# EAGLE design sqrwear-mini (EAGLE 6.5.0)
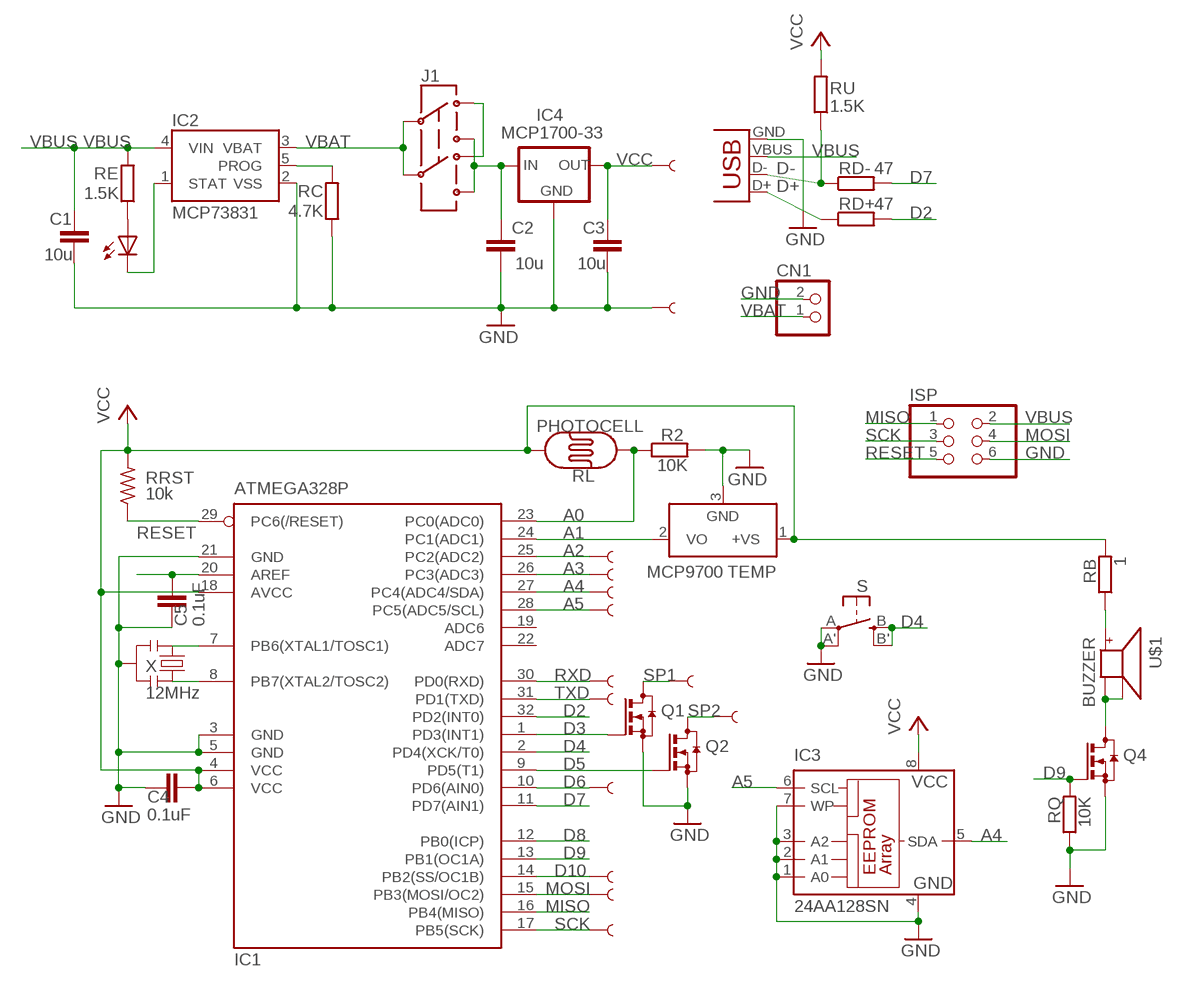
[diagram p0: schematic, sheet 1]

## Parts
C1  10u  C-EUC0805K  [C0805K]
C2  10u  C-EUC0805K  [C0805K]
C3  10u  C-EUC0805K  [C0805K]
C4  0.1uF  C-EUC0805K  [C0805K]
C5  0.1uF  C-EUC0805K  [C0805K]
CHG  0805  LEDCHIPLED_0805  [CHIPLED_0805]
CN1  JST_2PIN-SMT-RA  [JST-PH-2-SMT-RA]
IC1  ATMEGA328P  MEGA8-AI  [TQFP32-08]
IC2  MCP73831  [SOT23-5]
IC3  24AA128SN  [SO-08]
IC4  MCP1700-33  MCP1700SOT233  [SOT23]
ISP  PINHD-2X3  [2X03]
J1  AYZ0202  [AYZ0202]
PAD_3  SEWTAP6  SEWTAP611  [PETAL-SMALL-2SIDE11]
PAD_5  SEWTAP6  SEWTAP61  [PETAL-SMALL-2SIDE1]
PAD_6  SEWTAP6  SEWTAP61  [PETAL-SMALL-2SIDE1]
PAD_10  SEWTAP6  SEWTAP611  [PETAL-SMALL-2SIDE11]
PAD_11  SEWTAP6  SEWTAP61  [PETAL-SMALL-2SIDE1]
PAD_13  SEWTAP6  SEWTAP61  [PETAL-SMALL-2SIDE1]
PAD_A2  SEWTAP6  SEWTAP61  [PETAL-SMALL-2SIDE1]
PAD_A3  SEWTAP6  SEWTAP61  [PETAL-SMALL-2SIDE1]
PAD_A4  SEWTAP6  SEWTAP611  [PETAL-SMALL-2SIDE11]
PAD_A5  SEWTAP6  SEWTAP611  [PETAL-SMALL-2SIDE11]
PAD_GND  SEWTAP6  SEWTAP611  [PETAL-SMALL-2SIDE11]
PAD_RXD  SEWTAP61  [PETAL-SMALL-2SIDE1]
PAD_TXD  SEWTAP6  SEWTAP61  [PETAL-SMALL-2SIDE1]
PAD_VCC  SEWTAP6  SEWTAP611  [PETAL-SMALL-2SIDE11]
Q1  BSS123  [SOT23]
Q2  BSS123  [SOT23]
Q4  BSS123  [SOT23]
R2  10K  R-EU_R0805  [R0805]
RB  1  R-EU_R0805  [R0805]
RC  4.7K  R-EU_R0805  [R0805]
RD+  47  R-EU_R0805  [R0805]
RD-  47  R-EU_R0805  [R0805]
RE  1.5K  R-EU_R0805  [R0805]
RL  PHOTOCELL  PHOTOCELLPTH  [PHOTOCELL]
RQ  10K  R-EU_R0805  [R0805]
RRST  10k  R-US_R0805  [R0805]
RU  1.5K  R-EU_R0805  [R0805]
S  EVQQ2  [EVQ-Q2]
TEMP  MCP9700  LM50  [SOT23]
U$1  BUZZER  [SMT-8585-BUZZER]
X  12MHz  RESONATORSMD  [RESONATOR-SMD]
X1  USBSMD  [USB-MINIB]

## Nets
A0: IC1.23(PC0(ADC0)) R2.1 RL.1
A1: IC1.24(PC1(ADC1)) TEMP.2(VO)
A2: IC1.25(PC2(ADC2)) PAD_A2.1
A3: IC1.26(PC3(ADC3)) PAD_A3.1
A4: IC1.27(PC4(ADC4/SDA)) IC3.5(SDA) PAD_A4.1
A5: IC1.28(PC5(ADC5/SCL)) IC3.6(SCL) PAD_A5.1
AREF: C5.2 IC1.20(AREF)
D2: IC1.32(PD2(INT0)) RD+.2
D3: IC1.1(PD3(INT1)) Q1.1(G)
D4: IC1.2(PD4(XCK/T0)) S.B'(S1) S.B(S)
D5: IC1.9(PD5(T1)) Q2.1(G)
D6: IC1.10(PD6(AIN0)) PAD_6.1
D7: IC1.11(PD7(AIN1)) RD-.2
D8: IC1.12(PB0(ICP))
D9: IC1.13(PB1(OC1A)) Q4.1(G) RQ.2
D10: IC1.14(PB2(SS/OC1B)) PAD_10.1
D+: RD+.1 X1.D+
D-: RD-.1 RU.1 X1.D-
GND: C1.2 C2.2 C3.2 C4.1 C5.1 CN1.2 IC1.3(GND) IC1.5(GND) IC1.21(GND) IC2.2(VSS) IC3.1(A0) IC3.2(A1) IC3.3(A2) IC3.4(GND) IC3.7(WP) IC4.1(GND) ISP.6 PAD_GND.1 Q1.2(S) Q2.2(S) Q4.2(S) R2.2 RC.1 RQ.1 S.A'(P1) S.A(P) TEMP.3(GND) X1.GND X.2
MISO: IC1.16(PB4(MISO)) ISP.1
MOSI: IC1.15(PB3(MOSI/OC2)) ISP.4 PAD_11.1
N$1: J1.3 J1.6
N$2: IC1.7(PB6(XTAL1/TOSC1)) X.1
N$3: IC1.8(PB7(XTAL2/TOSC2)) X.3
N$4: CHG.A RE.1
N$5: CHG.C IC2.1(STAT)
N$6: IC2.5(PROG) RC.2
N$7: Q4.3(D) U$1.- U$1.A-
N$12: RB.1 U$1.+
RESET: IC1.29(PC6(/RESET)) ISP.5 RRST.1
RXD: IC1.30(PD0(RXD)) PAD_RXD.1
SCK: IC1.17(PB5(SCK)) ISP.3 PAD_13.1
SP1: PAD_3.1 Q1.3(D)
SP2: PAD_5.1 Q2.3(D)
TXD: IC1.31(PD1(TXD)) PAD_TXD.1
VBAT: CN1.1 IC2.3(VBAT) J1.2 J1.5
VBUS: C1.1 IC2.4(VIN) ISP.2 RE.2 X1.VBUS
VCC: C3.1 C4.2 IC1.4(VCC) IC1.6(VCC) IC1.18(AVCC) IC3.8(VCC) IC4.2(OUT) PAD_VCC.1 RB.2 RL.2 RRST.2 RU.2 TEMP.1(+VS)
VDD: C2.1 IC4.3(IN) J1.1 J1.4
Unconnected: IC1.19(ADC6) IC1.22(ADC7)

## Library data of the parts
C1-C3 = resistor:C-EU: CAPACITOR, European symbol
C4 C5 = rcl:C-EU: CAPACITOR, European symbol
CHG = led:LED: LED OSRAM: - CHIPLED LG R971, LG N971, LY N971, LG Q971, LY Q971, LO R971, LY R971 LH N974, LH R974 LS Q976, LO Q976, LY Q976 LO Q996 - Hyper CHIPLED LW Q18S LB Q993, LB Q99A, LB R99A - SideLED LS A670, LO A670, LY A670, LG A670, LP A670 LB A673, LV A673, LT A673, LW A673 LH A674 LY A675 LS A676, LA A676, LO A676, LY A676, LW A676 LS A679, LY A679, LG A679 - Hyper Micro SIDELED® LS Y876, LA Y876, LO Y876, LY Y876 LT Y87S - SmartLED LW L88C, LW L88S LB L89C, LB L89S, LG L890 LS L89K, LO L89K, LY L89K LS L896, LA L896, LO L896, LY L896 - TOPLED LS T670, LO T670, LY T670, LG T670, LP T670 LSG T670, LSP T670, LSY T670, LOP T670, LYG T670 LG T671, LOG T671, LSG T671 LB T673, LV T673, LT T673, LW T673 LH T674 LS T676, LA T676, LO T676, LY T676, LB T676, LH T676, LSB T676, LW T676 LB T67C, LV T67C, LT T67C, LS T67K, LO T67K, LY T67K, LW E67C LS E67B, LA E67B, LO E67B, LY E67B, LB E67C, LV E67C, LT E67C LW T67C LS T679, LY T679, LG T679 LS T770, LO T770, LY T770, LG T770, LP T770 LB T773, LV T773, LT T773, LW T773 LH T774 LS E675, LA E675, LY E675, LS T675 LS T776, LA T776, LO T776, LY T776, LB T776 LHGB T686 LT T68C, LB T68C - Hyper Mini TOPLED® LB M676 - Mini TOPLED Santana® LG M470 LS M47K, LO M47K, LY M47K Source: http://www.osram.convergy.de LUXEON: - LUMILED® LXK2-PW12-R00, LXK2-PW12-S00, LXK2-PW14-U00, LXK2-PW14-V00 LXK2-PM12-R00, LXK2-PM12-S00, LXK2-PM14-U00 LXK2-PE12-Q00, LXK2-PE12-R00, LXK2-PE12-S00, LXK2-PE14-T00, LXK2-PE14-U00 LXK2-PB12-K00, LXK2-PB12-L00, LXK2-PB12-M00, LXK2-PB14-N00, LXK2-PB14-P00, LXK2-PB14-Q00 LXK2-PR12-L00, LXK2-PR12-M00, LXK2-PR14-Q00, LXK2-PR14-R00 LXK2-PD12-Q00, LXK2-PD12-R00, LXK2-PD12-S00 LXK2-PH12-R00, LXK2-PH12-S00 LXK2-PL12-P00, LXK2-PL12-Q00, LXK2-PL12-R00 Source: www.luxeon.com KINGBRIGHT: KA-3528ASYC Source: www.kingbright.com
CN1 = adafruit:JST_2PIN: JST 2-Pin Connectors of various flavors SMT-RA (S2B-PH-SM4) 4UConnector #17311 SMT (B2B-PH-SM4) THM-RA (S2B-PH) THM (B2B-PH)
IC1 = atmel:MEGA8: MICROCONTROLLER 8 Kbytes FLASH, 1 kbytes SRAM, 512 bytes EEPROM, USART, 6-channel 10 bit ADC, 2-channel 8 bit ADC Pin compatible with Atmega48, ATMega88, ATMega168 Source: avr.lbr; MPN: ATMEGA8-16AU; OC_FARNELL: 9171371; OC_NEWARK: 73M8863
IC2 = SparkFunNew:MCP73831: Microchip's MCP73831 Miniature single cell, fully integrated Li-Ion, Li-polymer charge management controller http://ww1.microchip.com/downloads/en/DeviceDoc/21984a.pdf
IC3 = microchip:24*: Serial EEPROM I2C; MF: MICROCHIP; MPN: 24AA128-I/SN; OC_FARNELL: unknown; OC_NEWARK: 92C6842
IC4 = adafruit:MCP1700: VOLTAGE REGULATOR
ISP = pinhead:PINHD-2X3: PIN HEADER
J1 = SparkFunNew:AYZ0202: SPDT Slide Switch Simple SMD single-pull double-throw slide switch. Good for less than 350mA power switch, switching UARTs between devices, etc. Spark Fun Electronics SKU : COM-00597
PAD_3 PAD_5 PAD_6 PAD_10 PAD_11 PAD_13 PAD_A2-PAD_A5 PAD_GND PAD_RXD PAD_TXD PAD_VCC = LilyPad-Wearables:SEWTAP
Q1 Q2 Q4 = transistor-small-signal:BSS123: N-CHANNEL MOS FET
R2 RB RC RD+ RD- RE RQ RU = rcl:R-EU_: RESISTOR, European symbol
RL = SparkFunNew:PHOTOCELL: Photocell Also known as a CdS photoresistor. This is a low cost way to detect light levels. Resistance decreases with more incoming light. SparkFun SKU: SEN-09088
RRST = rcl:R-US_: RESISTOR, American symbol
S = adafruit:EVQQ2: SMT 6mm switch, EVQQ2 series http://www.ladyada.net/library/eagle
TEMP = linear:LM50: SOT-23 Single-Supply Centigrade Temperature Sensor Vout = (10mV/°C x Temp °C) +5mmmV Source: http://cache.national.com/ds/LM/LM50.pdf
U$1 = adafruit:BUZZER
X = SparkFunNew:RESONATOR: Resonator Small SMD resonator. This is the itty bitty 10/20MHz resonators with built in caps. CSTCE10M0G55 and CSTCE20M0V53. Footprint has been reviewed closely but hasn't been tested yet.
X1 = SparkFun:USB: USB Connectors USB-B-PTH is fully proven SKU : PRT-00139 USB-miniB is fully proven SKU : PRT-00587 USB-A-PCB is untested. USB-A-H is throughly reviewed, but untested. Spark Fun Electronics SKU : PRT-00437 USB-B-SMT is throughly reviewed, but untested. Needs silkscreen touching up. USB-A-S has not been used/tested USB-MB-H has not been used/tested

## Net classes
0 default: width 0.203 mm, clearance 0.203 mm
1 power: width 0.203 mm, clearance 0.203 mm

## Board
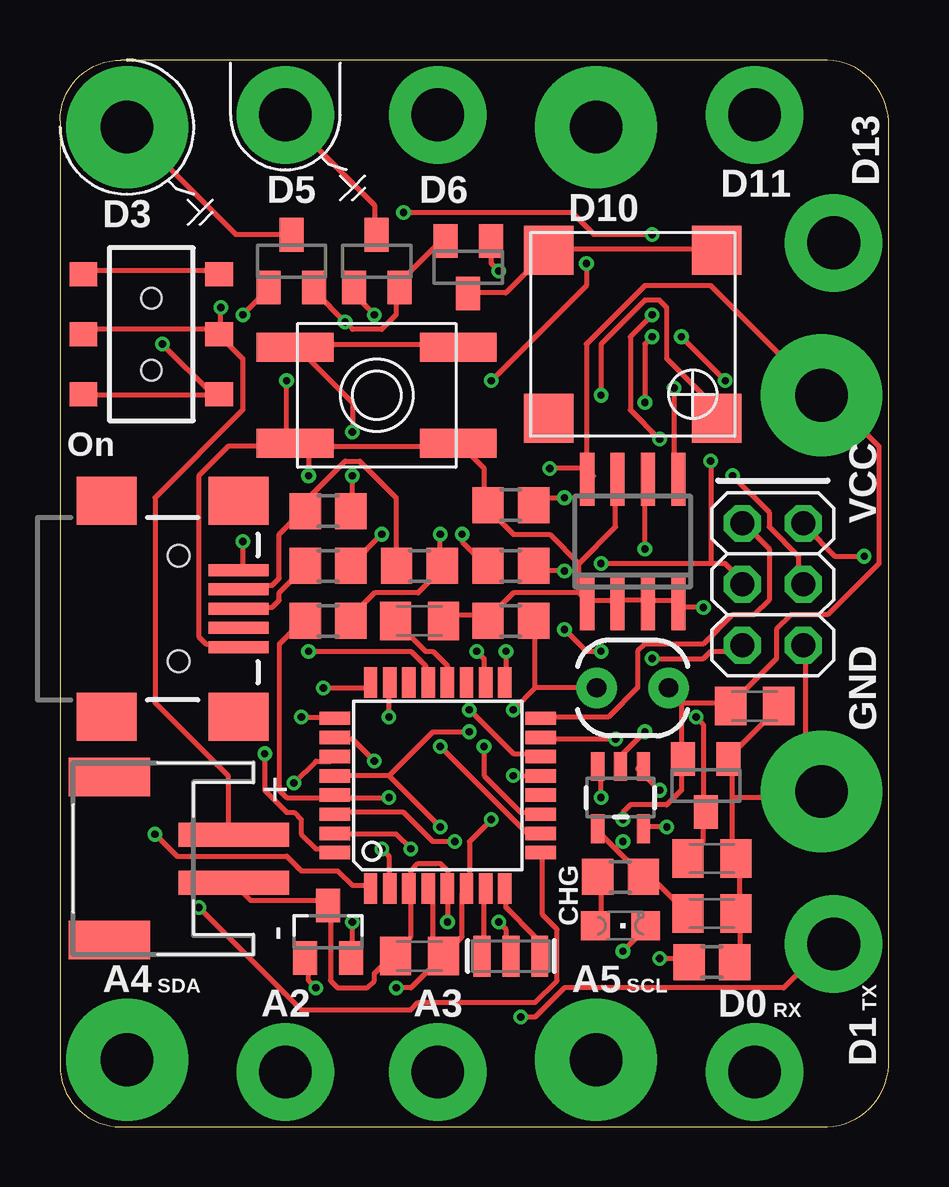
[diagram p1: board, top side]
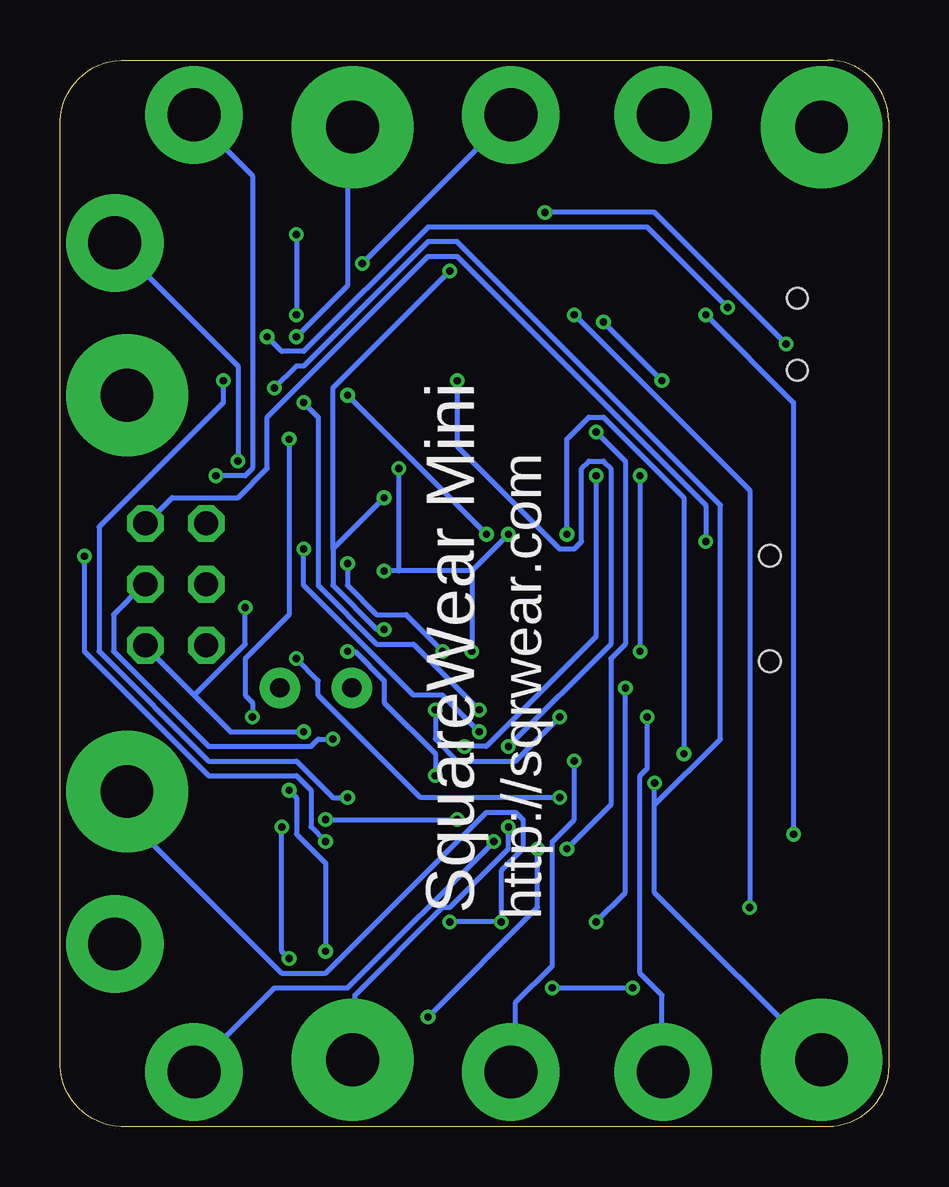
[diagram p2: board, bottom side, seen from below]

Size 34.54 x 44.45 mm. Coordinates in mm from the lower left corner, seen from the top.
Outline: 2.54,0 31.75,0 arc90 34.54,2.54 34.54,41.91 arc90 31.75,44.45 2.54,44.45 arc90 0,41.91 0,2.54 arc90 2.54,0
Copper layers (1*16): Top 0.035mm / dielectric 1.5mm / Bottom 0.035mm
Design rules "Fusion_eagle_rule_v1.1 *": minimum track width 6mil, minimum drill 12mil, track to track 6mil, track to pad 6mil, pad to pad 6mil, via to via 6mil, smd to smd 0mil, copper to edge 10mil, drill to drill 10mil, minimum pad ring 10mil, minimum via ring 6mil, stop-mask expansion 2mil, vias tented up to drill 100mil, thermal gap 25mil
vRestrict: area 20.8,8.4 to 21.6,10.4; area 21.1,37.6 to 23.9,38.9; area 8.4,4.6 to 10.4,5.6

### Footprints (pad centres in the part's own frame; a part is rotated, then mirrored left to right if it is on the bottom)
C0805K = smd 1.3 x 1.6: 1 -1,0; 2 1,0
CHIPLED_0805 = smd 1.2 x 1.2: A 0,-1.05; C 0,1.05
JST-PH-2-SMT-RA = smd 1 x 4.6: 1 1,-3.7; 2 -1,-3.7 | smd 1.6 x 3.4: NC1 -3.4,1.5; NC2 3.4,1.5
TQFP32-08 = smd 1.27 x 0.559: 1 -4.293,2.8; 2 -4.293,2; 3 -4.293,1.2; 4 -4.293,0.4; 5 -4.293,-0.4; 6 -4.293,-1.2; 7 -4.293,-2; 8 -4.293,-2.8; 17 4.293,-2.8; 18 4.293,-2; 19 4.293,-1.2; 20 4.293,-0.4; 21 4.293,0.4; 22 4.293,1.2; 23 4.293,2; 24 4.293,2.8 | smd 0.559 x 1.27: 9 -2.8,-4.293; 10 -2,-4.293; 11 -1.2,-4.293; 12 -0.4,-4.293; 13 0.4,-4.293; 14 1.2,-4.293; 15 2,-4.293; 16 2.8,-4.293; 25 2.8,4.293; 26 2,4.293; 27 1.2,4.293; 28 0.4,4.293; 29 -0.4,4.293; 30 -1.2,4.293; 31 -2,4.293; 32 -2.8,4.293
SOT23-5 = smd 0.55 x 1.2: 1 -0.95,-1.3; 2 0,-1.3; 3 0.95,-1.3; 4 0.95,1.3; 5 -0.95,1.3
SO-08 = smd 0.6 x 2.2: 1 -1.905,-2.6; 2 -0.635,-2.6; 3 0.635,-2.6; 4 1.905,-2.6; 5 1.905,2.6; 6 0.635,2.6; 7 -0.635,2.6; 8 -1.905,2.6
SOT23 = smd 1 x 1.4: 1 -0.95,-1.1; 2 0.95,-1.1; 3 0,1.1
2X03 = drill 1.016 octagon: 1 -2.54,-1.27; 2 -2.54,1.27; 3 0,-1.27; 4 0,1.27; 5 2.54,-1.27; 6 2.54,1.27
AYZ0202 = smd 1 x 1.15: 1 -2.5,2.825; 2 0,2.825; 3 2.5,2.825; 4 -2.5,-2.825; 5 0,-2.825; 6 2.5,-2.825 | hole 0.85: 1.5,0; -1.5,0
PETAL-SMALL-2SIDE11 = drill 2.2 pad 5.08: 1 0,0
PETAL-SMALL-2SIDE1 = drill 2.2 pad 4.064: 1 0,0
R0805 = smd 1.3 x 1.5: 1 -0.95,0; 2 0.95,0
PHOTOCELL = drill 0.8 pad 1.676: 1 -1.5,0; 2 1.5,0
EVQ-Q2 = smd 3.2 x 1.2: A -3.4,-2; A' 3.4,-2; B -3.4,2; B' 3.4,2
SMT-8585-BUZZER = smd 2.05 x 2.05: + -3.5,-3.5; - 3.5,-3.5; A- 3.5,3.5; NC1 -3.5,3.5
RESONATOR-SMD = smd 0.7 x 1.7: 1 -1.2,0; 2 0,0; 3 1.2,0
USB-MINIB = smd 2.5 x 0.5: D+ 2.5,0; D- 2.5,0.8; GND 2.5,-1.6; ID 2.5,-0.8; VBUS 2.5,1.6 | smd 2.5 x 2: GND@1 -3,-4.5; GND@2 -3,4.5; GND@3 2.5,4.5; GND@4 2.5,-4.5 | hole 0.9: 0,2.2; 0,-2.2

### Placement (x,y rotation side)
C1  27.18,8.89 0 top
C2  27.18,11.18 0 top
C3  28.96,17.53 0 top
C4  14.99,7.11 0 top
C5  14.99,21.08 180 top
CHG  23.37,8.38 270 top
CN1  3.56,11.18 90 top
IC1  15.75,14.22 90 top
IC2  23.37,13.72 180 top
IC3  23.88,24.38 0 top
IC4  26.92,14.22 180 top
ISP  29.72,22.61 270 top
J1  3.81,33.02 90 top
PAD_3  2.79,41.66 180 top
PAD_5  9.4,42.16 180 top
PAD_6  15.75,42.16 0 top
PAD_10  22.35,41.66 180 top
PAD_11  28.96,42.16 180 top
PAD_13  32.26,36.83 180 top
PAD_A2  9.4,2.29 0 top
PAD_A3  15.75,2.29 0 top
PAD_A4  2.79,2.79 90 top
PAD_A5  22.35,2.79 0 top
PAD_GND  31.75,13.97 270 top
PAD_RXD  28.96,2.29 180 top
PAD_TXD  32.26,7.62 0 top
PAD_VCC  31.75,30.48 180 top
Q1  9.65,36.07 0 top
Q2  13.21,36.07 0 top
Q4  17.02,35.81 180 top
R2  18.8,21.08 180 top
RB  18.8,23.37 0 top
RC  27.18,6.86 180 top
RD+  11.18,23.37 0 top
RD-  11.18,25.65 0 top
RE  23.37,10.41 0 top
RL  23.88,18.29 0 top
RQ  18.8,25.91 0 top
RRST  11.18,21.08 0 top
RU  14.99,23.37 0 top
S  13.21,30.48 0 top
TEMP  11.18,8.13 0 top
U$1  23.88,33.02 90 top
X  18.8,7.11 0 top
X1  4.95,21.59 0 top

### Tracks (layer width: path | path; a pad name or v marks a point on that pad's centre or on a via)
A0  (via drill 0.3)
  Top 0.203: v13.72,17.07 13.72,18.29 IC1.23 | 19.81,18.29 v18.9,17.37 | RL.1 19.81,18.29 | 19.81,18.29 19.81,21.03 R2.1
  Bottom 0.203: v13.72,17.07 15.54,15.24 17.98,15.24 18.9,16.15 v18.9,17.37
A1  (via drill 0.3)
  Top 0.203: v10.97,18.29 12.8,18.29 IC1.24 | v12.19,8.53 12.19,7.32 TEMP.2
  Bottom 0.203: v10.97,18.29 10.97,9.75 v12.19,8.53
A2  (via drill 0.3)
  Top 0.203: v10.06,17.07 11.28,17.07 IC1.25
  Bottom 0.203: v10.06,17.07 10.06,14.94 10.36,14.63 10.36,6.4 9.45,5.49 9.45,2.44 PAD_A2.1
A3  (via drill 0.3)
  Top 0.203: v13.11,15.24 12.19,16.15 11.58,16.15 IC1.26
  Bottom 0.203: v13.11,15.24 13.11,12.8 14.02,11.89 14.02,6.71 15.54,5.18 15.54,2.44 PAD_A3.1
A4  (via drill 0.3)
  Top 0.203: v9.75,14.33 10.67,15.24 11.28,15.24 IC1.27 | v25.6,30.79 25.6,27.13 IC3.5
  Bottom 0.203: 9.75,13.41 9.75,9.75 PAD_A4.1 | 9.75,13.41 v9.75,14.33 | v25.6,30.79 24.69,31.7 24.38,31.7 19.2,36.88 17.98,36.88 7.01,25.91 7.01,16.15 9.75,13.41
A5  (via drill 0.3)
  Top 0.203: 13.72,14.63 11.58,14.63 IC1.28 | v15.85,12.5 13.72,14.63 | v24.38,24.08 24.38,26.82 IC3.6 | v17.07,16.46 15.54,16.46 13.72,14.63
  Bottom 0.203: v15.85,12.5 15.85,11.58 18.29,9.14 18.59,9.14 22.25,5.49 22.25,3.05 PAD_A5.1 | v24.38,24.08 24.38,22.56 19.81,17.98 18.59,17.98 v17.07,16.46
AREF
  Top 0.203: IC1.20 16.15,18.59 16.15,19.2 15.54,19.81 15.24,19.81 14.02,21.03 C5.2
D2  (via drill 0.3)
  Top 0.203: v8.53,15.55 8.53,14.02 9.45,13.11 9.75,13.11 10.06,12.8 10.06,12.19 10.67,11.58 11.28,11.58 IC1.32 | v13.41,24.69 12.19,23.47 RD+.2
  Bottom 0.203: v8.53,15.55 8.53,26.21 11.89,29.57 12.5,29.57 13.41,28.65 v13.41,24.69
D3  (via drill 0.3)
  Top 0.203: v3.96,12.19 4.88,11.28 9.45,11.28 10.06,10.67 11.58,10.67 12.19,10.06 12.8,10.06 IC1.1 | v7.62,33.83 8.53,34.75 Q1.1
  Bottom 0.203: v3.96,12.19 3.96,30.18 v7.62,33.83
D4  (via drill 0.3)
  Top 0.203: v13.41,11.58 13.72,11.28 13.72,10.06 IC1.2 | v12.19,28.96 12.19,30.18 10.06,32.31 S.B 10.06,32.61 16.46,32.61 S.B'
  Bottom 0.203: v13.41,11.58 11.58,13.41 11.58,19.51 10.97,20.12 10.97,27.74 v12.19,28.96
D5  (via drill 0.3)
  Top 0.203: v5.79,9.14 10.06,4.88 14.63,4.88 14.94,5.18 19.81,5.18 20.73,6.1 20.73,8.23 20.12,8.84 20.12,11.28 IC1.9 | v13.11,33.83 12.19,34.75 Q2.1
  Bottom 0.203: v5.79,9.14 5.79,26.52 v13.11,33.83
D6  (via drill 0.3)
  Top 0.203: v15.85,15.85 19.51,12.19 19.81,12.19 IC1.10 | v17.98,31.09 21.95,35.05 v21.95,35.97
  Bottom 0.203: v15.85,15.85 11.58,20.12 11.58,27.43 11.89,27.74 12.5,27.74 12.8,27.43 12.8,24.38 13.11,24.08 13.72,24.08 17.98,28.35 v17.98,31.09 | PAD_6.1 v21.95,35.97
D7  (via drill 0.3)
  Top 0.203: v17.68,15.85 17.68,14.63 19.2,13.11 19.81,13.11 IC1.11 | v12.19,27.13 12.19,25.91 RD-.2
  Bottom 0.203: v17.68,15.85 16.76,15.85 12.19,20.42 v12.19,27.13
D9  (via drill 0.3)
  Top 0.203: v18.9,14.63 19.81,14.63 IC1.13 | v22.55,19.81 21.95,19.81 v21.03,20.73 | v21.03,26.21 20.12,26.21 19.81,25.91 RQ.2 | v18.29,35.66 17.98,35.97 17.98,36.88 Q4.1
  Bottom 0.203: v18.9,14.63 18.9,15.55 21.03,17.68 21.03,18.59 22.25,19.81 v22.55,19.81 | v21.03,20.73 21.34,20.73 23.16,22.56 23.16,24.08 | v21.03,26.21 23.16,24.08 | v18.29,35.66 23.16,30.79 23.16,24.08
D10  (via drill 0.3)
  Top 0.203: v17.07,17.37 18.9,15.55 19.81,15.55 IC1.14 | v24.38,30.18 24.38,32.61 v24.69,32.92
  Bottom 0.203: v17.07,17.37 19.81,20.12 21.34,20.12 23.77,22.56 23.77,29.57 v24.38,30.18 | v24.69,32.92 22.55,35.05 22.55,41.45 PAD_10.1
D+
  Top 0.203: RD+.1 10.06,23.17 9.14,22.25 9.14,21.95 8.84,21.64 7.62,21.64 X1.D+
D-
  Top 0.203: X1.D- 7.62,22.56 8.84,22.56 9.14,22.86 9.14,24.69 10.06,25.6 RD-.1 10.06,25.91 11.89,27.74 12.5,27.74 14.02,26.21 14.02,23.47 RU.1
GND  (via drill 0.3)
  Top 0.203: 25.91,21.95 IC3.4 | IC3.4 25.6,21.95 24.69,21.95 IC3.3 24.38,21.95 23.47,21.95 IC3.2 23.16,21.95 22.25,21.95 IC3.1 21.95,21.95 21.64,22.25 | C5.1 16.15,21.34 17.68,21.34 R2.2 17.98,21.34 18.9,22.25 21.64,22.25 | 21.64,23.47 23.16,24.99 23.16,26.82 IC3.7 | 21.64,22.25 21.64,23.47 | Q1.2 10.67,34.75 v11.89,33.53 12.19,33.22 13.41,33.22 14.02,33.83 14.02,34.75 Q2.2 14.02,35.05 15.85,36.88 Q4.2 | 17.68,25.91 17.68,27.43 16.76,28.35 S.A' 16.46,28.35 10.06,28.35 | 15.54,18.59 IC1.21 15.24,18.59 15.24,19.2 14.63,19.81 v10.36,19.81 | v10.36,27.13 10.36,28.04 10.06,28.35 | 9.45,28.35 9.75,28.35 S.A | 9.45,28.35 7.01,28.35 5.79,27.13 5.79,20.42 6.1,20.12 7.32,20.12 X1.GND | 10.06,28.35 S.A | 9.45,28.35 v9.45,31.09 | 9.45,28.35 S.A | 21.64,23.47 20.42,24.69 18.9,24.69 17.68,25.91 | 17.68,25.91 RQ.1 | v18.29,8.53 18.59,8.23 18.59,7.32 X.2 | v16.15,8.53 16.15,9.75 IC1.5 16.15,10.06 16.15,10.67 15.85,10.97 14.94,10.97 14.63,10.67 14.63,10.06 IC1.3 14.63,9.75 14.63,7.93 14.02,7.32 C4.1 13.72,7.01 13.11,6.4 13.11,6.1 12.8,5.79 11.58,5.79 11.28,6.1 11.28,9.14 TEMP.3 | 11.28,9.45 TEMP.3 | TEMP.3 10.97,9.45 7.92,9.45 7.32,10.06 CN1.2 | v24.38,16.46 23.47,15.55 23.47,15.24 IC2.2 | C3.2 29.87,17.37 28.04,15.55 IC4.1 28.04,15.24 28.04,13.72 | RC.1 28.35,7.01 28.35,8.84 C1.2 28.35,9.14 28.35,10.97 C2.2 28.04,11.28 28.04,13.72 | 31.09,13.72 31.7,13.72 PAD_GND.1 31.09,13.72 | 31.09,13.72 28.04,13.72 | 31.09,13.72 31.09,19.81 ISP.6 | v26.82,21.64 25.91,21.64 IC3.4
  Bottom 0.203: v10.36,27.13 v10.36,19.81 | v9.45,31.09 v11.89,33.53 | v18.29,8.53 v16.15,8.53 16.15,10.67 15.24,11.58 15.24,12.8 15.54,13.11 16.76,13.11 23.47,6.4 25.3,6.4 31.7,12.8 31.7,13.72 PAD_GND.1 | v24.38,16.46 27.43,16.46 28.96,17.98 | 28.96,17.98 30.79,19.81 ISP.6 | v26.82,21.64 26.82,20.12 28.96,17.98
MISO
  Top 0.203: IC1.16 20.12,17.07 22.86,17.07 24.08,18.29 24.08,19.81 24.38,20.12 26.82,20.12 28.04,21.34 28.96,21.34 29.57,21.95 29.57,24.08 28.65,24.99 ISP.1
MOSI  (via drill 0.3)
  Top 0.203: v23.16,16.15 20.12,16.15 IC1.15 | v28.04,27.13 29.57,25.6 29.57,24.99 30.79,23.77 30.79,22.86 ISP.4
  Bottom 0.203: v23.16,16.15 23.77,16.15 24.08,15.85 28.35,15.85 32.31,19.81 32.31,21.34 31.09,22.56 ISP.4 | v28.04,27.13 26.82,27.13 26.52,27.43 26.52,39.62 28.96,42.06 PAD_11.1
N$1
  Top 0.203: J1.3 1.22,35.66 6.4,35.66 J1.6
N$2
  Top 0.203: IC1.7 17.68,9.75 17.68,7.32 X.1
N$3
  Top 0.203: IC1.8 18.59,9.75 18.59,9.14 19.81,7.93 19.81,7.32 X.3
N$4
  Top 0.203: CHG.A 22.55,8.53 22.55,10.36 RE.1
N$5  (via drill 0.3)
  Top 0.203: v23.47,7.32 24.38,8.23 CHG.C | v24.99,14.02 24.08,14.94 IC2.1
  Bottom 0.203: v23.47,7.32 23.47,10.97 24.69,12.19 24.69,13.72 v24.99,14.02
N$6  (via drill 0.3)
  Top 0.203: v25.3,12.5 24.38,12.5 IC2.5 | v24.99,7.01 26.21,7.01 RC.2
  Bottom 0.203: v25.3,12.5 25.3,7.32 v24.99,7.01
N$7
  Top 0.203: Q4.3 17.07,34.75 18.59,34.75 20.12,36.27 U$1.A- 20.42,36.58 27.13,36.58 U$1.-
N$12  (via drill 0.3)
  Top 0.203: v16.76,24.69 16.76,24.38 17.68,23.47 RB.1 | v22.55,30.48 22.55,32.61 24.38,34.44 24.99,34.44 25.3,34.14 25.3,32 27.13,30.18 27.13,29.57 U$1.+
  Bottom 0.203: v22.55,30.48 v16.76,24.69
RESET  (via drill 0.3)
  Top 0.203: RRST.1 10.06,21.03 9.14,20.12 9.14,14.02 9.45,13.72 11.28,13.72 IC1.29 11.58,13.72 v13.72,13.72 | v24.69,19.51 26.82,19.51 27.13,19.81 28.35,19.81 ISP.5
  Bottom 0.203: v24.69,19.51 23.77,18.59 23.77,17.98 19.51,13.72 v13.72,13.72
RXD  (via drill 0.3)
  Top 0.203: v16.46,11.89 15.54,11.89 14.33,13.11 11.58,13.11 IC1.30
  Bottom 0.203: v16.46,11.89 22.55,5.79 25.6,5.79 28.96,2.44 PAD_RXD.1
SCK  (via drill 0.3)
  Top 0.203: v18.59,19.81 18.59,18.59 IC1.17 | 27.13,23.47 27.74,23.47 28.35,22.86 ISP.3 | 27.13,23.47 v22.55,23.47 | v27.13,27.74 27.13,23.47
  Bottom 0.203: v18.59,19.81 20.12,21.34 21.34,21.34 22.55,22.56 v22.55,23.47 | v27.13,27.74 27.13,31.7 PAD_13.1
SP1
  Top 0.203: Q1.3 9.45,37.19 7.32,37.19 3.05,41.45 PAD_3.1
SP2
  Top 0.203: Q2.3 13.11,37.19 13.11,38.41 9.45,42.06 PAD_5.1
TXD  (via drill 0.3)
  Top 0.203: v14.63,11.58 14.02,12.19 11.58,12.19 IC1.31 | v19.2,4.57 19.81,4.57 21.03,5.79 30.18,5.79 32,7.62 PAD_TXD.1
  Bottom 0.203: v14.63,11.58 14.63,9.14 v19.2,4.57
VBAT  (via drill 0.3)
  Top 0.203: J1.2 1.22,33.22 6.4,33.22 J1.5 | v22.55,13.72 22.55,14.94 IC2.3 | v25.91,32.92 v27.74,31.09 | v6.71,34.14 6.71,33.22 J1.5 | CN1.1 7.01,12.19 7.01,14.63 3.96,17.68 3.96,26.21 7.62,29.87 7.62,32 6.71,32.92 J1.5
  Bottom 0.203: v22.55,13.72 23.16,13.72 24.69,15.24 28.35,15.24 32.92,19.81 32.92,24.99 27.74,30.18 v27.74,31.09 | v25.91,32.92 25.3,32.31 24.38,32.31 19.2,37.49 10.06,37.49 v6.71,34.14
VBUS  (via drill 0.3)
  Top 0.203: 23.16,11.58 24.08,10.67 RE.2 24.38,10.67 25.91,9.14 C1.1 | 23.16,11.58 22.55,12.19 IC2.4 | v7.62,24.38 7.62,23.17 X1.VBUS | v23.47,11.89 23.16,11.58 | v33.53,23.77 32.31,23.77 31.09,24.99 ISP.2
  Bottom 0.203: v7.62,24.38 7.62,25.91 17.98,36.27 19.2,36.27 25.91,29.57 25.91,27.43 27.13,26.21 29.87,26.21 30.79,25.3 ISP.2 | v23.47,11.89 24.08,12.5 24.08,14.02 24.69,14.63 28.35,14.63 33.53,19.81 v33.53,23.77
VCC  (via drill 0.3)
  Top 0.203: v17.37,19.81 17.68,19.51 17.68,18.59 IC1.18 | v15.85,24.69 15.85,23.47 RU.2 15.85,23.17 14.94,22.25 13.11,22.25 12.19,21.34 RRST.2 | v21.03,23.17 19.81,23.17 RB.2 | IC1.4 15.54,9.75 15.54,7.62 15.85,7.32 C4.2 | C4.2 16.15,7.32 16.76,7.93 16.76,9.75 IC1.6 17.07,10.06 17.07,11.89 v17.98,12.8 | 25.91,17.68 25.91,17.98 25.6,18.29 RL.2 25.91,17.68 | 25.91,17.68 25.91,15.55 IC4.2 25.91,15.24 25.91,14.02 25.3,13.41 23.77,13.41 23.47,13.11 v23.47,12.8 | 25.91,17.68 27.74,17.68 C3.1 28.04,17.68 29.87,19.51 29.87,20.73 30.48,21.34 32,21.34 34.14,23.47 34.14,28.35 32,30.48 PAD_VCC.1 31.7,30.48 27.13,35.05 24.38,35.05 21.95,32.61 21.95,27.43 | 22.25,27.13 IC3.8 | 21.95,27.43 21.95,27.13 IC3.8 | 21.95,27.43 v20.42,27.43 | 21.95,27.43 IC3.8 | v10.67,5.79 10.36,6.1 10.36,7.01 TEMP.1 | v14.02,5.79 14.63,5.79 15.85,7.01 C4.2
  Bottom 0.203: 17.37,23.17 v17.37,19.81 | v15.85,24.69 17.37,23.17 | 17.37,23.17 20.42,23.17 | 20.42,23.17 v21.03,23.17 | v23.47,12.8 v17.98,12.8 | v20.42,27.43 20.42,23.17 | v14.02,5.79 v10.67,5.79
VDD  (via drill 0.3)
  Top 0.203: C2.1 26.21,11.28 26.82,11.89 26.82,13.11 IC4.3 26.82,13.41 26.82,16.76 v26.52,17.07 | 6.4,30.48 1.22,30.48 J1.1 | v24.99,28.65 23.77,29.87 23.77,32.92 v24.69,33.83 | v24.69,37.19 22.25,37.19 21.34,38.1 v14.33,38.1 | 6.4,30.48 v4.27,32.61 | 6.4,30.48 J1.4
  Bottom 0.203: v26.52,17.07 26.52,17.68 26.82,17.98 26.82,19.51 24.99,21.34 v24.99,28.65 | v24.69,37.19 v24.69,33.83 | v14.33,38.1 9.75,38.1 v4.27,32.61

### Text on the board
tNames: D13 | D5 | D6 | D11 | D3 | D10 | On | VCC | GND | A4 | SDA | A5 | SCL | A2 | A3 | D0 | RX | TX | D1
bNames: http://sqrwear.com | SquareWear Mini